# EAGLE schematic drola_end_node (EAGLE 8.3.1)
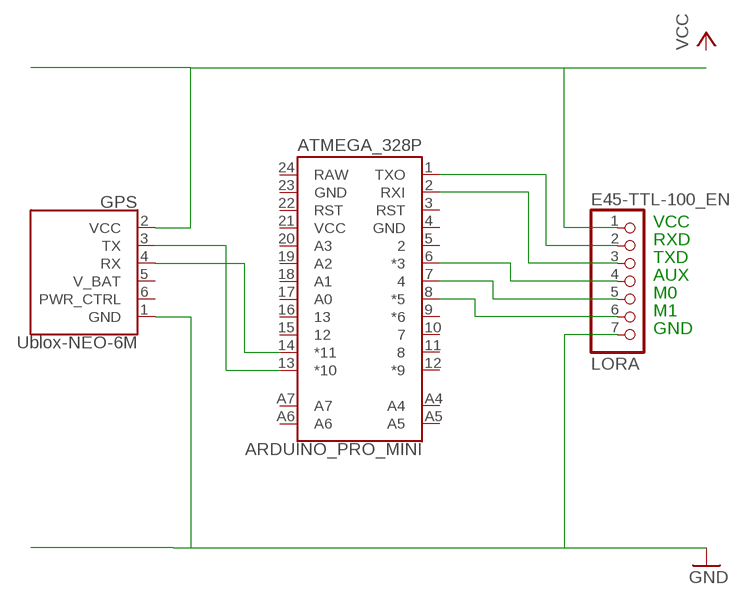
[diagram p0: schematic, sheet 1]

## Parts
ATMEGA_328P  ARDUINO_PRO_MINI  [ARDUINO_PRO_MINI]
E45-TTL-100_EN  LORA  PINHD-1X7/90  [1X07/90]
GPS  Ublox-NEO-6M  GP-735T-VERTICAL  [JST-6PIN-1MM]

## Nets
GND: E45-TTL-100_EN.7 GPS.1(GND)
N$1: E45-TTL-100_EN.1 GPS.2(VCC)
N$2: ATMEGA_328P.2(RXI) E45-TTL-100_EN.3
N$3: ATMEGA_328P.1(TXO) E45-TTL-100_EN.2
N$4: ATMEGA_328P.6(*3) E45-TTL-100_EN.4
N$5: ATMEGA_328P.7 E45-TTL-100_EN.5
N$6: ATMEGA_328P.8(*5) E45-TTL-100_EN.6
N$8: ATMEGA_328P.14(*11) GPS.4(RX)
N$9: ATMEGA_328P.13(*10) GPS.3(TX)
Unconnected: ATMEGA_328P.3(RST) ATMEGA_328P.5 ATMEGA_328P.9(*6) ATMEGA_328P.10 ATMEGA_328P.11 ATMEGA_328P.12(*9) ATMEGA_328P.15 ATMEGA_328P.16 ATMEGA_328P.17(A0) ATMEGA_328P.18(A1) ATMEGA_328P.19(A2) ATMEGA_328P.20(A3) ATMEGA_328P.22(RST) ATMEGA_328P.A4 ATMEGA_328P.A5 ATMEGA_328P.A6 ATMEGA_328P.A7 GPS.5(V_BAT) GPS.6(PWR_CTRL)

## Notes on the sheet
- VCC
- RXD
- TXD
- AUX
- M0
- M1
- GND

## Power pins joined to a net without a drawn wire
GND: ATMEGA_328P.4(GND) ATMEGA_328P.23(GND)
RAW: ATMEGA_328P.24(RAW)
VCC: ATMEGA_328P.21(VCC)

## Library data of the parts
ATMEGA_328P = SparkFun-Boards:ARDUINO_PRO_MINI: SparkFun Pro Mini Pro Mini compatible footprint. Dimensions: 0.7 x 1.3" PCB Thickness: 0.8mm SparkFun Products: 3.3V/8MHz <https://www.sparkfun.com/products/11114> 5V/16MHz <https://www.sparkfun.com/products/11113>
E45-TTL-100_EN = pinhead:PINHD-1X7: PIN HEADER
GPS = SparkFun-GPS:GP-735T: ADH-tech GP-735 - Easy-to-use, Ultra-high performance, GPS Smart Antenna Module ADH-tech GP-735 is a slim, ultra-high performance, easy to use GPS smart antenna module designed with u-blox’s latest 7th generation single chip. This feature rich GPS module not only shortens the design efforts but also provides powerful functions. The compact design allows fast adoption and high yield production. The power control feature is very convenient to turn on/off power just via GPIO control pin. It’s especially useful to turn off power as the GPS function is not needed in the host applications. Datasheet <https://cdn.sparkfun.com/datasheets/GPS/GP-735T-150203.pdf> SparkFun Products GPS Receiver - GP-735 (56 Channel) <https://www.sparkfun.com/products/13670> (GPS-13670); PROD_ID: CONN-08249